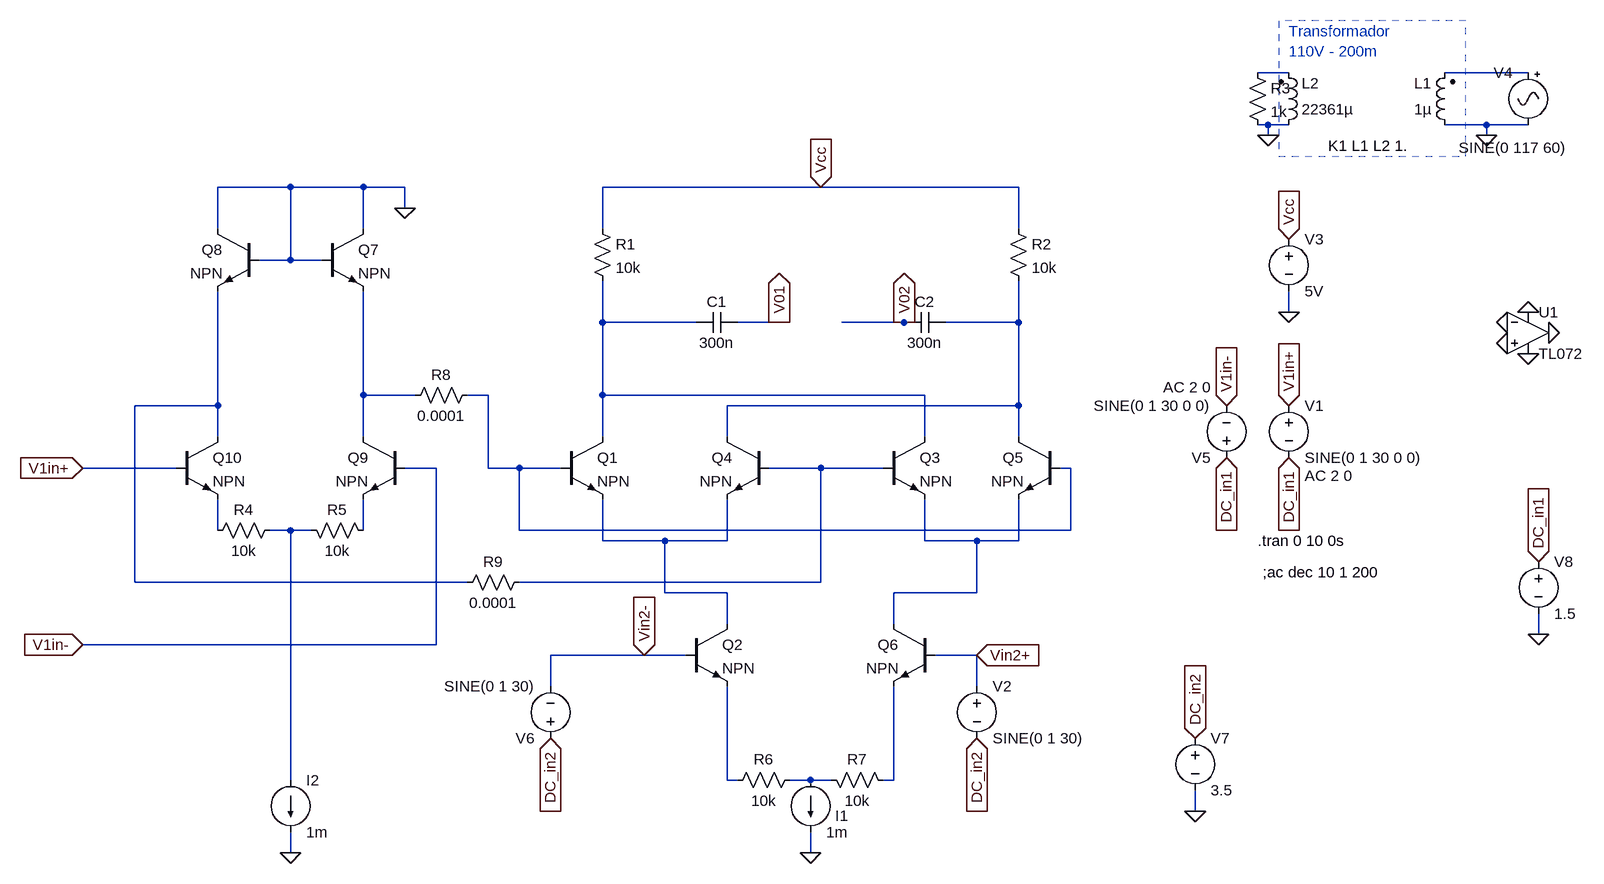
[diagram p0: schematic Celula_Gilbert_2106_v1.asc]
Celula_Gilbert_2106_v1.asc, the LTspice schematic file:
Version 4
SHEET 1 1404 980
WIRE 832 -496 784 -496
WIRE 1200 -496 1072 -496
WIRE 800 -416 784 -416
WIRE 832 -416 800 -416
WIRE 1136 -416 1072 -416
WIRE 1200 -416 1136 -416
WIRE 800 -400 800 -416
WIRE 1136 -400 1136 -416
WIRE -704 -320 -816 -320
WIRE -592 -320 -704 -320
WIRE -528 -320 -592 -320
WIRE 112 -320 -224 -320
WIRE 416 -320 112 -320
WIRE -528 -288 -528 -320
WIRE -816 -256 -816 -320
WIRE -592 -256 -592 -320
WIRE -224 -256 -224 -320
WIRE 416 -256 416 -320
WIRE -704 -208 -704 -320
WIRE -704 -208 -752 -208
WIRE -656 -208 -704 -208
WIRE 832 -128 832 -160
WIRE -224 -112 -224 -176
WIRE -80 -112 -224 -112
WIRE 48 -112 -16 -112
WIRE 64 -112 48 -112
WIRE 240 -112 144 -112
WIRE 256 -112 240 -112
WIRE 416 -112 416 -176
WIRE 416 -112 304 -112
WIRE -592 0 -592 -160
WIRE -512 0 -592 0
WIRE -400 0 -432 0
WIRE -224 0 -224 -112
WIRE 272 0 -224 0
WIRE -816 16 -816 -160
WIRE -816 16 -944 16
WIRE 416 16 416 -112
WIRE 416 16 -32 16
WIRE -816 64 -816 16
WIRE -592 64 -592 0
WIRE -224 64 -224 0
WIRE -32 64 -32 16
WIRE 272 64 272 0
WIRE 416 64 416 16
WIRE -880 112 -1024 112
WIRE -480 112 -528 112
WIRE -400 112 -400 0
WIRE -352 112 -400 112
WIRE -288 112 -352 112
WIRE 112 112 32 112
WIRE 208 112 112 112
WIRE 496 112 480 112
WIRE -816 208 -816 160
WIRE -704 208 -736 208
WIRE -672 208 -704 208
WIRE -592 208 -592 160
WIRE -352 208 -352 112
WIRE 496 208 496 112
WIRE 496 208 -352 208
WIRE -224 224 -224 160
WIRE -128 224 -224 224
WIRE -32 224 -32 160
WIRE -32 224 -128 224
WIRE 272 224 272 160
WIRE 352 224 272 224
WIRE 416 224 416 160
WIRE 416 224 352 224
WIRE -944 288 -944 16
WIRE -432 288 -944 288
WIRE 112 288 112 112
WIRE 112 288 -352 288
WIRE -128 304 -128 224
WIRE -32 304 -128 304
WIRE 352 304 352 224
WIRE 352 304 224 304
WIRE -32 352 -32 304
WIRE 224 352 224 304
WIRE 1216 368 1216 336
WIRE -480 384 -480 112
WIRE -480 384 -1024 384
WIRE -160 400 -304 400
WIRE -96 400 -160 400
WIRE 352 400 288 400
WIRE -304 448 -304 400
WIRE 352 448 352 400
WIRE -704 592 -704 208
WIRE -32 592 -32 448
WIRE -16 592 -32 592
WIRE 96 592 64 592
WIRE 128 592 96 592
WIRE 224 592 224 448
WIRE 224 592 208 592
WIRE 688 640 688 608
WIRE -704 704 -704 672
WIRE 96 704 96 672
FLAG 96 704 0
FLAG 736 16 V1in-
IOPIN 736 16 In
FLAG 832 16 V1in+
IOPIN 832 16 In
FLAG 112 -320 Vcc
IOPIN 112 -320 In
FLAG 832 -240 Vcc
IOPIN 832 -240 In
FLAG 832 -128 0
FLAG 352 400 Vin2+
IOPIN 352 400 In
FLAG -160 400 Vin2-
IOPIN -160 400 In
FLAG 48 -112 V01
IOPIN 48 -112 Out
FLAG 240 -112 V02
IOPIN 240 -112 Out
FLAG 1136 -400 0
FLAG 800 -400 0
FLAG -704 704 0
FLAG -1024 112 V1in+
IOPIN -1024 112 In
FLAG -1024 384 V1in-
IOPIN -1024 384 In
FLAG 688 528 DC_in2
IOPIN 688 528 In
FLAG 688 640 0
FLAG 352 528 DC_in2
IOPIN 352 528 In
FLAG -304 528 DC_in2
IOPIN -304 528 In
FLAG 1200 -64 0
FLAG 1200 -128 0
FLAG 1232 -96 0
FLAG 1168 -112 0
FLAG 1168 -80 0
FLAG 1216 256 DC_in1
IOPIN 1216 256 In
FLAG 1216 368 0
FLAG 832 96 DC_in1
IOPIN 832 96 In
FLAG 736 96 DC_in1
IOPIN 736 96 In
FLAG -528 -288 0
SYMBOL voltage 832 0 R0
WINDOW 123 24 124 Left 2
WINDOW 39 0 0 Left 2
SYMATTR Value2 AC 2 0
SYMATTR InstName V1
SYMATTR Value SINE(0 1 30 0 0)
SYMBOL voltage 352 432 R0
WINDOW 123 0 0 Left 2
WINDOW 39 0 0 Left 2
SYMATTR InstName V2
SYMATTR Value SINE(0 1 30)
SYMBOL npn -288 64 R0
SYMATTR InstName Q1
SYMBOL npn -96 352 R0
SYMATTR InstName Q2
SYMBOL npn 208 64 R0
SYMATTR InstName Q3
SYMBOL npn 32 64 M0
SYMATTR InstName Q4
SYMBOL npn 480 64 M0
SYMATTR InstName Q5
SYMBOL npn 288 352 M0
SYMATTR InstName Q6
SYMBOL current 96 592 R0
WINDOW 123 0 0 Left 2
WINDOW 39 0 0 Left 2
WINDOW 0 38 55 Left 2
SYMATTR InstName I1
SYMATTR Value 1m
SYMBOL voltage 832 -256 R0
WINDOW 123 0 0 Left 2
WINDOW 39 0 0 Left 2
SYMATTR InstName V3
SYMATTR Value 5V
SYMBOL res -240 -272 R0
SYMATTR InstName R1
SYMATTR Value 10k
SYMBOL res 400 -272 R0
SYMATTR InstName R2
SYMATTR Value 10k
SYMBOL ind2 1088 -400 R180
WINDOW 0 36 80 Left 2
WINDOW 3 36 40 Left 2
SYMATTR InstName L1
SYMATTR Value 1µ
SYMATTR SpiceLine Rser=100
SYMBOL ind2 816 -400 M180
WINDOW 0 36 80 Left 2
WINDOW 3 36 40 Left 2
SYMATTR InstName L2
SYMATTR Value 22361µ
SYMATTR SpiceLine Rser=100
SYMBOL Misc\\signal 1200 -512 M0
WINDOW 3 -60 131 Left 2
WINDOW 123 0 0 Left 2
WINDOW 39 0 0 Left 2
SYMATTR Value SINE(0 117 60)
SYMATTR InstName V4
SYMBOL res 768 -512 R0
SYMATTR InstName R3
SYMATTR Value 1k
SYMBOL npn -656 -256 R0
SYMATTR InstName Q7
SYMBOL npn -752 -256 M0
SYMATTR InstName Q8
SYMBOL npn -528 64 M0
SYMATTR InstName Q9
SYMBOL npn -880 64 R0
SYMATTR InstName Q10
SYMBOL res -720 192 R90
WINDOW 0 0 56 VBottom 2
WINDOW 3 32 56 VTop 2
SYMATTR InstName R4
SYMATTR Value 10k
SYMBOL res -688 192 M90
WINDOW 0 0 56 VBottom 2
WINDOW 3 32 56 VTop 2
SYMATTR InstName R5
SYMATTR Value 10k
SYMBOL current -704 592 R0
WINDOW 123 0 0 Left 2
WINDOW 39 0 0 Left 2
SYMATTR InstName I2
SYMATTR Value 1m
SYMBOL res 80 576 R90
WINDOW 0 0 56 VBottom 2
WINDOW 3 32 56 VTop 2
SYMATTR InstName R6
SYMATTR Value 10k
SYMBOL res 112 576 M90
WINDOW 0 0 56 VBottom 2
WINDOW 3 32 56 VTop 2
SYMATTR InstName R7
SYMATTR Value 10k
SYMBOL cap -16 -128 R90
WINDOW 0 0 32 VBottom 2
WINDOW 3 32 32 VTop 2
SYMATTR InstName C1
SYMATTR Value 300n
SYMBOL cap 304 -128 R90
WINDOW 0 0 32 VBottom 2
WINDOW 3 32 32 VTop 2
SYMATTR InstName C2
SYMATTR Value 300n
SYMBOL res -416 -16 R90
WINDOW 0 0 56 VBottom 2
WINDOW 3 32 56 VTop 2
SYMATTR InstName R8
SYMATTR Value 0.0001
SYMBOL res -336 272 R90
WINDOW 0 0 56 VBottom 2
WINDOW 3 32 56 VTop 2
SYMATTR InstName R9
SYMATTR Value 0.0001
SYMBOL voltage 736 112 R180
WINDOW 123 24 124 Left 2
WINDOW 39 0 0 Left 2
SYMATTR Value2 AC 2 0
SYMATTR InstName V5
SYMATTR Value SINE(0 1 30 0 0)
SYMBOL voltage -304 544 R180
WINDOW 123 0 0 Left 2
WINDOW 39 0 0 Left 2
SYMATTR InstName V6
SYMATTR Value SINE(0 1 30)
SYMBOL TL072 1200 -160 R0
SYMATTR InstName U1
SYMBOL voltage 688 512 R0
WINDOW 123 0 0 Left 2
WINDOW 39 0 0 Left 2
SYMATTR InstName V7
SYMATTR Value 3.5
SYMBOL voltage 1216 240 R0
WINDOW 123 0 0 Left 2
WINDOW 39 0 0 Left 2
SYMATTR InstName V8
SYMATTR Value 1.5
TEXT 1016 -384 Right 2 !K1 L1 L2 1.
TEXT 832 -560 Left 2 ;Transformador \n110V - 200m
TEXT 784 224 Left 2 !.tran 0 10 0s
TEXT 792 272 Left 2 !;ac dec 10 1 200
LINE Normal 1104 -368 1104 -576 2
LINE Normal 816 -368 1104 -368 2
LINE Normal 816 -576 816 -368 2
LINE Normal 1104 -576 816 -576 2

The netlist it stands for:
* Celula_Gilbert_2106_v1.asc
V1 V1in+ DC_in1 SINE(0 1 30 0 0) AC 2 0
V2 Vin2+ DC_in2 SINE(0 1 30)
Q1 N003 N006 N012 0 NPN
Q2 N012 Vin2- N014 0 NPN
Q3 N003 N008 N013 0 NPN
Q4 N004 N008 N012 0 NPN
Q5 N004 N006 N013 0 NPN
Q6 N013 Vin2+ N016 0 NPN
I1 N015 0 1m
V3 Vcc 0 5V
R1 Vcc N003 10k
R2 Vcc N004 10k
L1 0 N002 1µ Rser=100
L2 0 N001 22361µ Rser=100
V4 N002 0 SINE(0 117 60)
R3 N001 0 1k
Q7 0 0 N005 0 NPN
Q8 0 0 N007 0 NPN
Q9 N005 V1in- N011 0 NPN
Q10 N007 V1in+ N009 0 NPN
R4 N010 N009 10k
R5 N010 N011 10k
I2 N010 0 1m
R6 N015 N014 10k
R7 N015 N016 10k
C1 V01 N003 300n
C2 N004 V02 300n
R8 N006 N005 0.0001
R9 N008 N007 0.0001
V5 DC_in1 V1in- SINE(0 1 30 0 0) AC 2 0
V6 DC_in2 Vin2- SINE(0 1 30)
* U1: TL072 (symbol TL072 not available, pins judged from their places): In+=0 In-=0 V+=0 V-=0 OUT=0
V7 DC_in2 0 3.5
V8 DC_in1 0 1.5
.model NPN NPN
.model PNP PNP
.lib standard.bjt
K1 L1 L2 1.
* Transformador
* 110V - 200m
.tran 0 10 0s
;ac dec 10 1 200
.backanno
.end